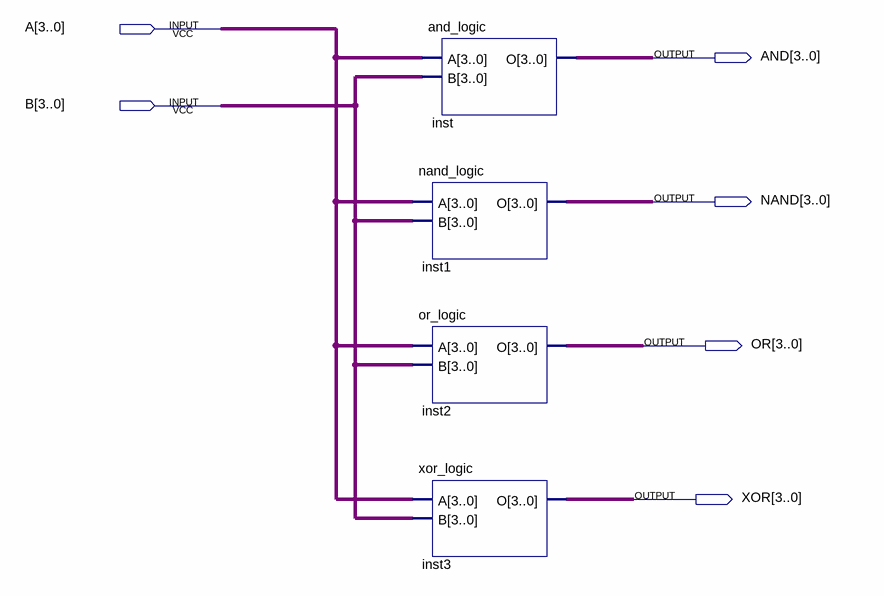
[diagram p0: schematic sheet]
// Quartus schematic LOGIC.bdf as structural Verilog: 4 symbols, 6 pins
module LOGIC (
  input  [3:0] A,
  input  [3:0] B,
  output [3:0] AND,
  output [3:0] NAND,
  output [3:0] OR,
  output [3:0] XOR
);

  and_logic inst (.A(A), .B(B), .O(AND));
  nand_logic inst1 (.A(A), .B(B), .O(NAND));
  or_logic inst2 (.A(A), .B(B), .O(OR));
  xor_logic inst3 (.A(A), .B(B), .O(XOR));
endmodule
